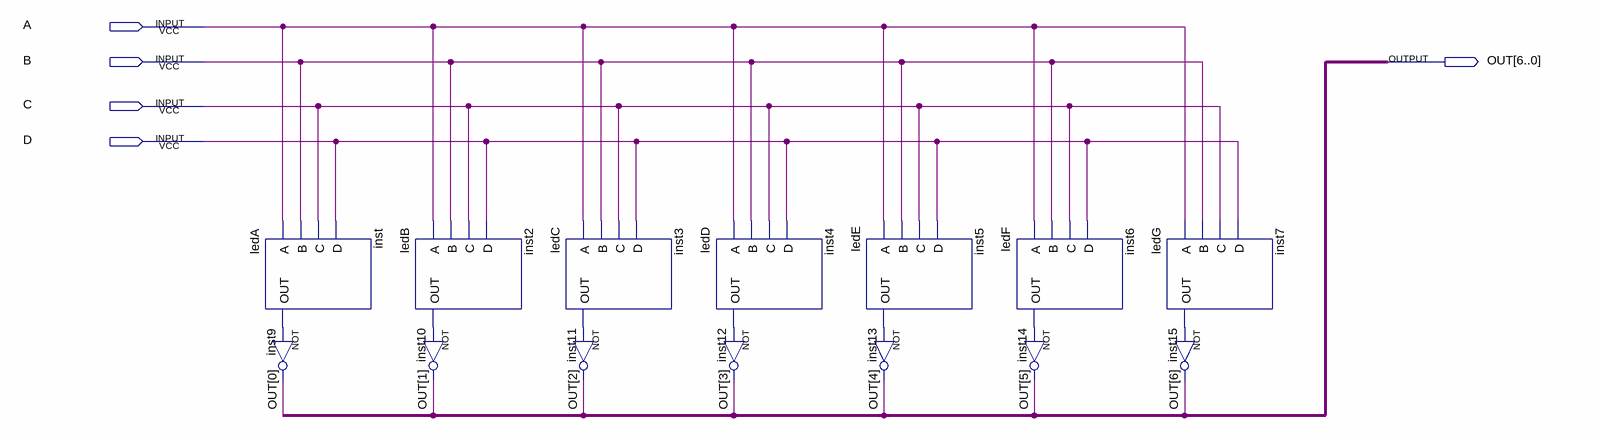
[diagram p0: schematic sheet]
// Quartus schematic decoddisplay.bdf as structural Verilog: 14 symbols, 5 pins
module decoddisplay (
  input  A,
  input  B,
  input  C,
  input  D,
  output [6:0] OUT
);

  wire inst2_out, inst3_out, inst4_out, inst5_out, inst6_out, inst7_out, inst_out;

  ledA inst (.A(A), .B(B), .C(C), .D(D), .OUT(inst_out));
  not inst9 (OUT[0], inst_out);
  ledB inst2 (.A(A), .B(B), .C(C), .D(D), .OUT(inst2_out));
  not inst10 (OUT[1], inst2_out);
  ledC inst3 (.A(A), .B(B), .C(C), .D(D), .OUT(inst3_out));
  not inst11 (OUT[2], inst3_out);
  ledD inst4 (.A(A), .B(B), .C(C), .D(D), .OUT(inst4_out));
  not inst12 (OUT[3], inst4_out);
  ledE inst5 (.A(A), .B(B), .C(C), .D(D), .OUT(inst5_out));
  not inst13 (OUT[4], inst5_out);
  ledF inst6 (.A(A), .B(B), .C(C), .D(D), .OUT(inst6_out));
  not inst14 (OUT[5], inst6_out);
  ledG inst7 (.A(A), .B(B), .C(C), .D(D), .OUT(inst7_out));
  not inst15 (OUT[6], inst7_out);
endmodule
